# Altium schematic sheet P_USB.SchDoc
size 209 x 297 mm; Author: ALTIUM GOSTBOM2.0 KEV; SheetNumber: 29; SheetTotal: 48
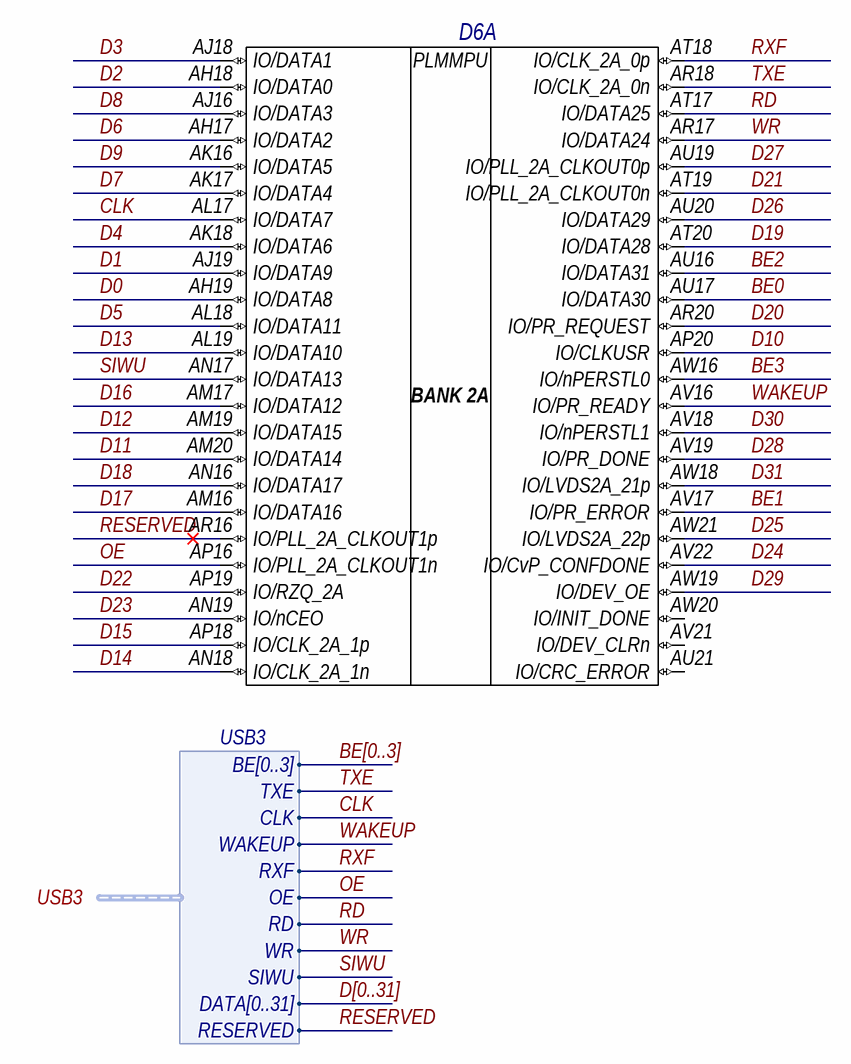
[diagram p0: P_USB.SchDoc]

## Parts
D6  10AS066N3F40E2SGE2  [ALTR-FBGA1517_A-350]  (value not drawn)  (part A of 39)

## Ports
USB3 (harness USB3)

## Harnesses
USB3: BE[0..3], TXE, CLK, WAKEUP, RXF, OE, RD, WR, SIWU, DATA[0..31], RESERVED

## Nets
BE0: D6.AU17(IO/DATA30)
BE1: D6.AV17(IO/PR_ERROR)
BE2: D6.AU16(IO/DATA31)
BE3: D6.AW16(IO/nPERSTL0)
CLK: D6.AL17(IO/DATA7) ; port USB3.CLK
D0: D6.AH19(IO/DATA8)
D1: D6.AJ19(IO/DATA9)
D2: D6.AH18(IO/DATA0)
D3: D6.AJ18(IO/DATA1)
D4: D6.AK18(IO/DATA6)
D5: D6.AL18(IO/DATA11)
D6: D6.AH17(IO/DATA2)
D7: D6.AK17(IO/DATA4)
D8: D6.AJ16(IO/DATA3)
D9: D6.AK16(IO/DATA5)
D10: D6.AP20(IO/CLKUSR)
D11: D6.AM20(IO/DATA14)
D12: D6.AM19(IO/DATA15)
D13: D6.AL19(IO/DATA10)
D14: D6.AN18(IO/CLK_2A_1n)
D15: D6.AP18(IO/CLK_2A_1p)
D16: D6.AM17(IO/DATA12)
D17: D6.AM16(IO/DATA16)
D18: D6.AN16(IO/DATA17)
D19: D6.AT20(IO/DATA28)
D20: D6.AR20(IO/PR_REQUEST)
D21: D6.AT19(IO/PLL_2A_CLKOUT0n)
D22: D6.AP19(IO/RZQ_2A)
D23: D6.AN19(IO/nCEO)
D24: D6.AV22(IO/CvP_CONFDONE)
D25: D6.AW21(IO/LVDS2A_22p)
D26: D6.AU20(IO/DATA29)
D27: D6.AU19(IO/PLL_2A_CLKOUT0p)
D28: D6.AV19(IO/PR_DONE)
D29: D6.AW19(IO/DEV_OE)
D30: D6.AV18(IO/nPERSTL1)
D31: D6.AW18(IO/LVDS2A_21p)
OE: D6.AP16(IO/PLL_2A_CLKOUT1n) ; port USB3.OE
RD: D6.AT17(IO/DATA25) ; port USB3.RD
RESERVED: D6.AR16(IO/PLL_2A_CLKOUT1p) ; port USB3.RESERVED
RXF: D6.AT18(IO/CLK_2A_0p) ; port USB3.RXF
SIWU: D6.AN17(IO/DATA13) ; port USB3.SIWU
TXE: D6.AR18(IO/CLK_2A_0n) ; port USB3.TXE
WAKEUP: D6.AV16(IO/PR_READY) ; port USB3.WAKEUP
WR: D6.AR17(IO/DATA24) ; port USB3.WR

Not connected (* = marked no-connect by the designer): D6 AU21(IO/CRC_ERROR) AV21(IO/DEV_CLRn) AW20(IO/INIT_DONE)

## Buses and harness runs
bus BE[0..3]
bus D[0..31]

## Notes on the sheet
- Подп. дата
- Инв. № дубл.
- Взам. инв. №
- Подп. и дата
- Инв. № подл.
- Изм.
- Лист
- № докум.
- Подп.
- Дата
- Файл:
- ALTIUM GOSTBOM2.0 KEV
- Копировал
- Формат А4
- (in symbol E105, part A) PLMMPU; BANK 2A

## Library data of the parts
D6 = E105: Arria 10 SX Family, 588 I/O Pins, 16 Fractional PLLs, 1517-Pin FBGA, Speed Grade 2, Extended Grade, RoHS; Тип элемента: ПЛИС; Old_des: U1; New_des: D6; UID: E105; Component Kind: Standard; ComponentLink1Description: Manufacturer URL; ComponentLink1URL: https://www.altera.com/; ComponentLink2Description: Datasheet; ComponentLink2URL: https://www.altera.com/content/dam/altera-www/global/en_US/pdfs/literature/hb/arria-10/a10_datasheet.pdf; PartNumber: 10AS066N3F40E2SGE2; DatasheetVersion: Rev. 2016-06-24, 06/2016; Mounting Technology: Surface Mount; PackageDescription: 1517-Pin FineLine Ball-Grid Array (FBGA), Body 40 x 40 mm, Pitch 1 mm; Code_JEDEC: MS-034; ComponentLink3Description: Package Specification; ComponentLink3URL: https://www.altera.com/content/dam/altera-www/global/en_US/pdfs/literature/packaging/04r00461-04.pdf; PackageVersion: Rev. 5.0, 01/2016